# Altium schematic sheet RGMII.schdoc: =
size A3; Symbol: Sheet-Symbol_A4; Company: 嘉立创EDA; Version: V1.0; Page Size: A4; @Project Name: RK3568B2地瓜派; @Page Count: 27; @Update Date: 2025-09-23; @Create Date: 2025-09-11; @Schematic Name: Schematic1; @Page No: 20; @Page Name: RGMII; Device: Sheet-Symbol_A4; Border: 1; Title Block Position: 3; Width: 1655; Height: 1170; Region Start: 1; X Region Count: 6; Y Region Count: 4; Blade Width: 10; @Board Name: Board1; @Create Time: 22:20:05; @Update Time: 09:49:09; Organization: ORGANIZATION; Address1: ADDRESS 1; Address2: ADDRESS 2; Address3: ADDRESS 3; Address4: ADDRESS 4; SheetNumber: 19; SheetTotal: 28
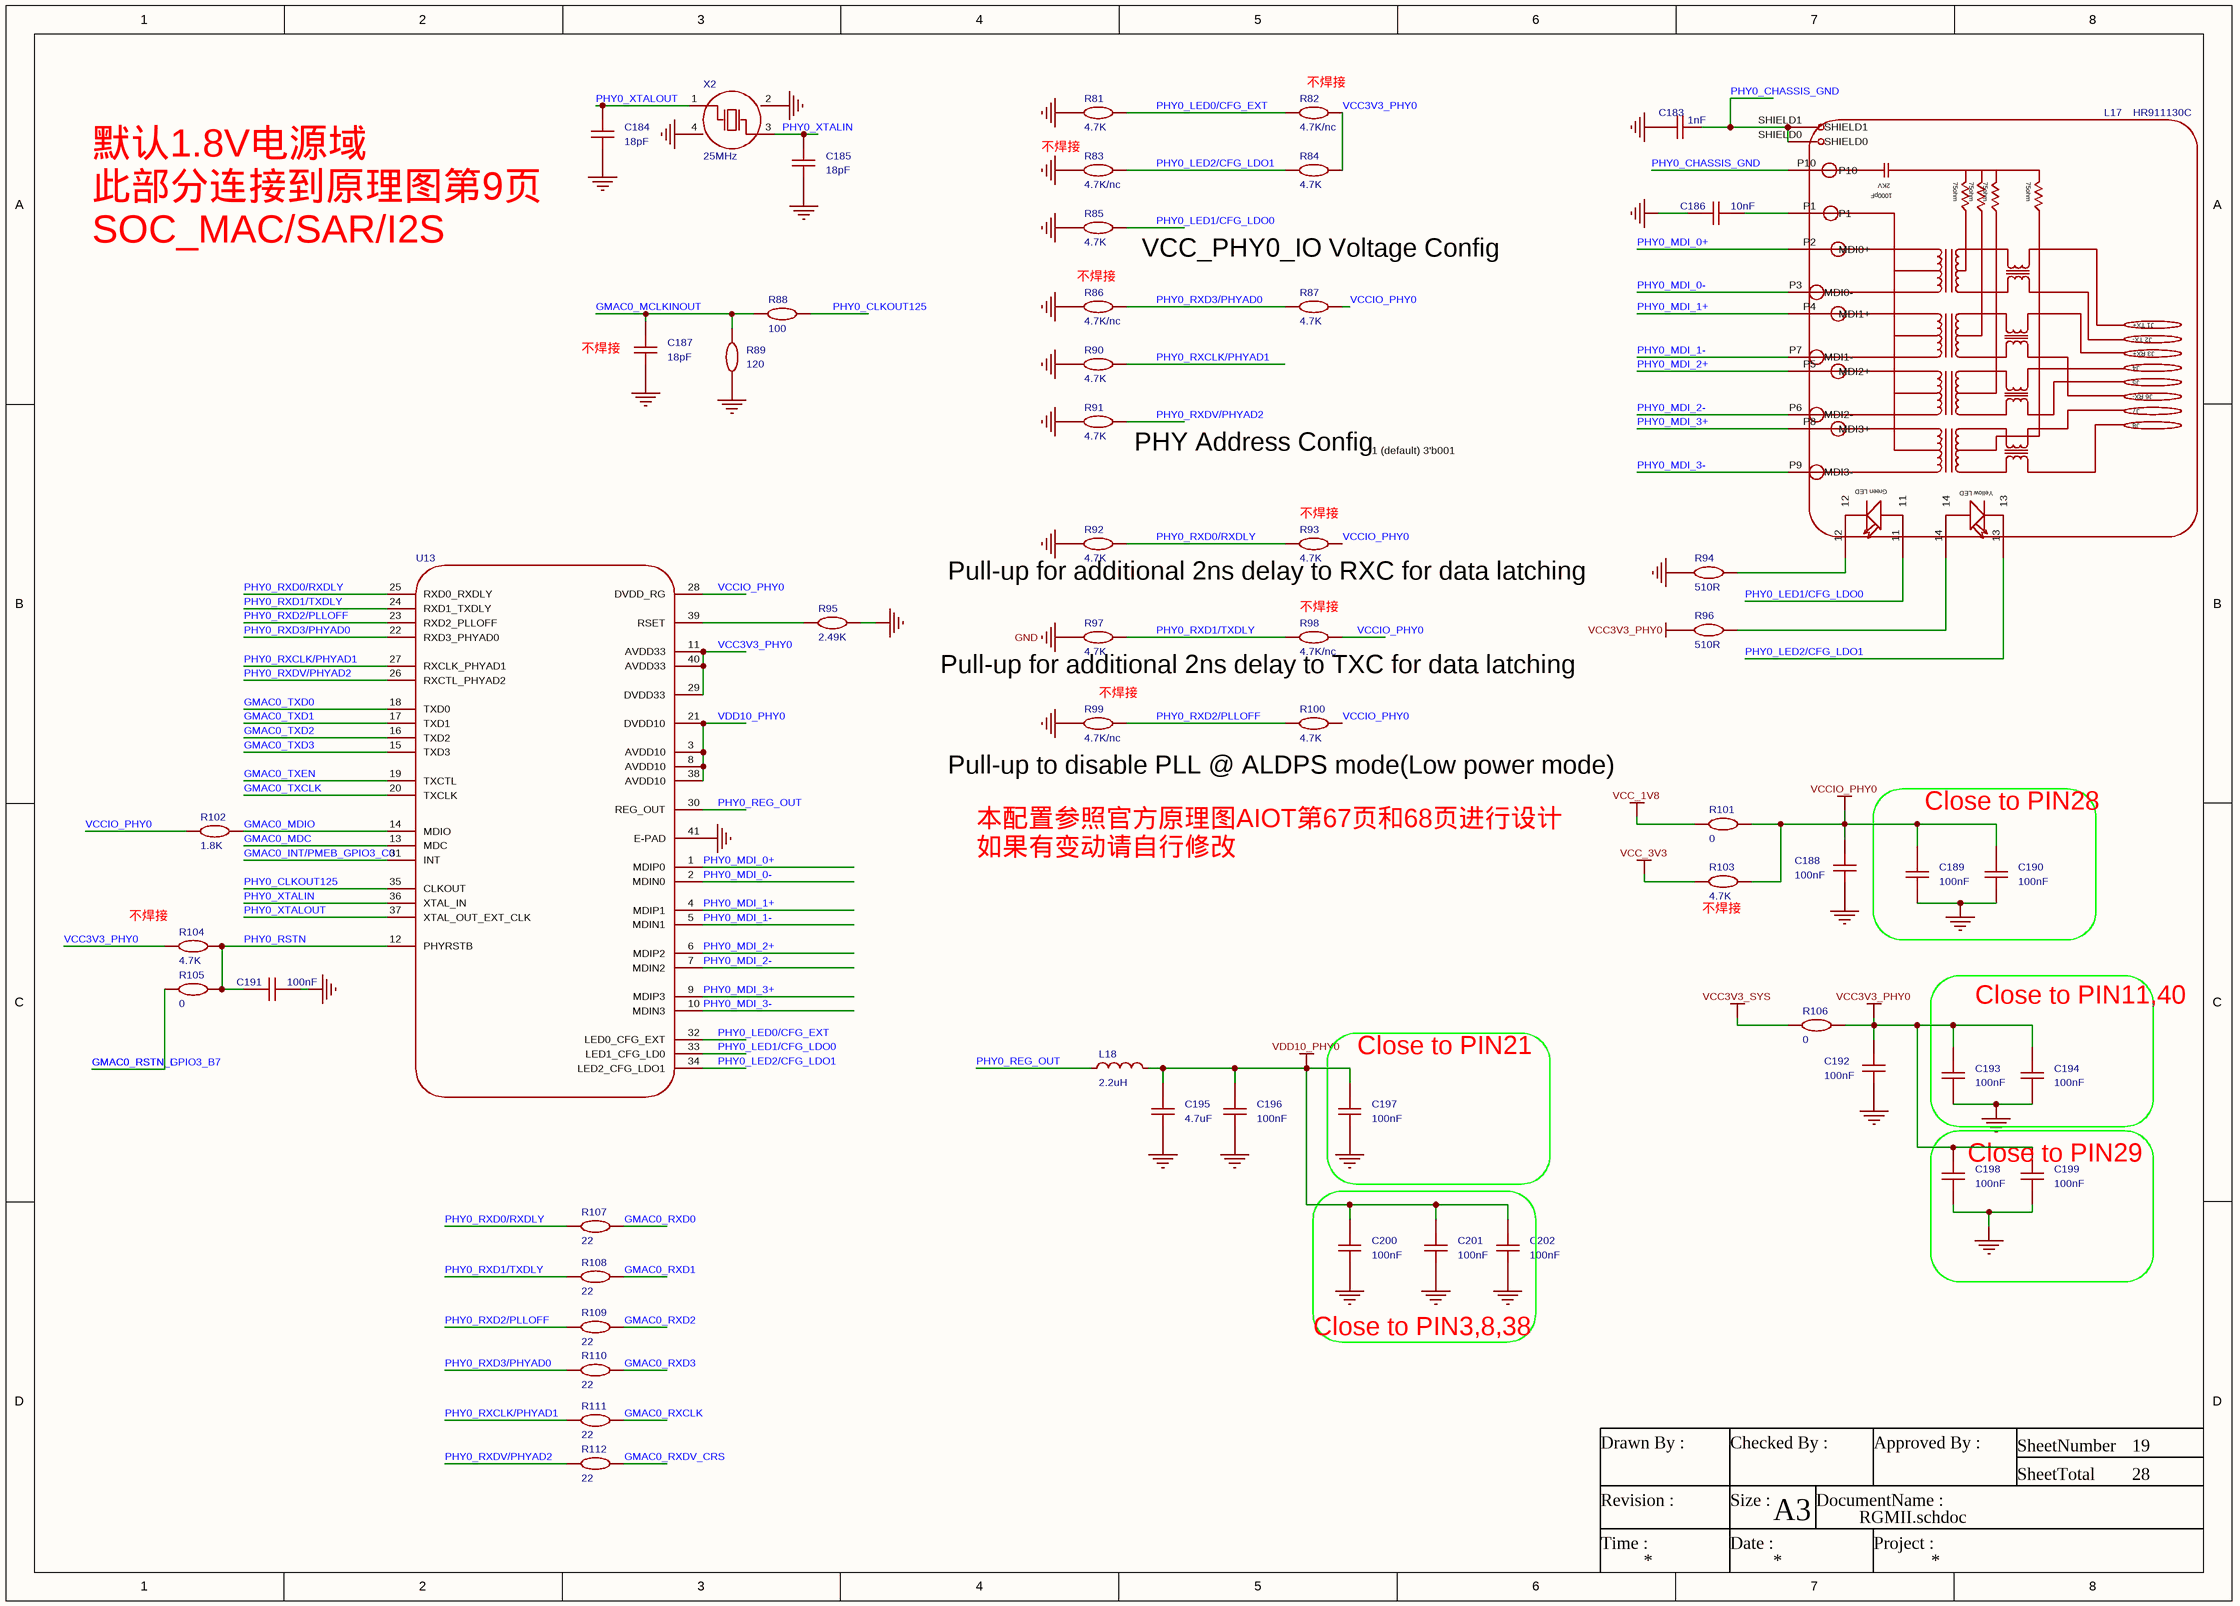
[diagram p0: RGMII.schdoc]

## Parts
C183  1nF  [C1206]
C184  value 18pF  [MYC0402]  (hidden comment: CL10A105KB8NNNC)
C185  value 18pF  [MYC0402]  (hidden comment: CL10A105KB8NNNC)
C186  value 10nF  [MYC0402]  (hidden comment: CL10A105KB8NNNC)
C187  value 18pF  [MYC0402]  (hidden comment: CL10A105KB8NNNC)
C188  100nF  [C0603]
C189  value 100nF  [MYC0402]  (hidden comment: CL10A105KB8NNNC)
C190  value 100nF  [MYC0402]  (hidden comment: CL10A105KB8NNNC)
C191  value 100nF  [MYC0402]  (hidden comment: CL10A105KB8NNNC)
C192  100nF  [C0603]
C193  value 100nF  [MYC0402]  (hidden comment: CL10A105KB8NNNC)
C194  value 100nF  [MYC0402]  (hidden comment: CL10A105KB8NNNC)
C195  4.7uF  [C0603]
C196  value 100nF  [MYC0402]  (hidden comment: CL10A105KB8NNNC)
C197  value 100nF  [MYC0402]  (hidden comment: CL10A105KB8NNNC)
C198  100nF  [C0603]
C199  value 100nF  [MYC0402]  (hidden comment: CL10A105KB8NNNC)
C200  value 100nF  [MYC0402]  (hidden comment: CL10A105KB8NNNC)
C201  value 100nF  [MYC0402]  (hidden comment: CL10A105KB8NNNC)
C202  value 100nF  [MYC0402]  (hidden comment: CL10A105KB8NNNC)
L17  HR911130C  [RJ45-TH_HR911130C]
L18  2.2uH  [IND-SMD_L2.5-W2.0_MHCHL2520]
R81  4.7K  [R0402]
R82  4.7K/nc  [R0402]
R83  4.7K/nc  [R0402]
R84  4.7K  [R0402]
R85  4.7K  [R0402]
R86  4.7K/nc  [R0402]
R87  4.7K  [R0402]
R88  100  [R0402]
R89  120  [R0402]
R90  4.7K  [R0402]
R91  4.7K  [R0402]
R92  4.7K  [R0402]
R93  4.7K  [R0402]
R94  510R  [R0402]
R95  2.49K  [R0402]
R96  510R  [R0402]
R97  4.7K  [R0402]
R98  4.7K/nc  [R0402]
R99  4.7K/nc  [R0402]
R100  4.7K  [R0402]
R101  0  [R0603]
R102  1.8K  [R0402]
R103  4.7K  [R0402]  (no BOM)
R104  4.7K  [R0402]
R105  0  [R0402]
R106  0  [R0603]
R107  22  [R0402]
R108  22  [R0402]
R109  22  [R0402]
R110  22  [R0402]
R111  22  [R0402]
R112  22  [R0402]
U13  (no value)  [RTL8211F-CG]
X2  25MHz  [CRYSTAL-SMD_4P-L3.2-W2.5-BL]

## Blocks framed on the sheet
Close to PIN28: C189 C190
Close to PIN11,40: C193 C194
Close to PIN21: C197
Close to PIN29: C198 C199
Close to PIN3,8,38: C200-C202

## Nets
GND: C183.1 C184.2 C185.2 C186.2 C187.2 C188.1 C189.2 C190.2 C191.1 C192.1 C193.2 C194.2 C195.1 C196.2 C197.2 C198.1 C199.2 C200.2 C201.2 C202.2 R81.1 R83.1 R85.1 R86.1 R89.1 R90.1 R91.1 R92.1 R94.1 R95.2 R97.1 R99.1 U13.41(E-PAD) X2.2(GND) X2.4(GND)
VCC3V3_PHY0: C192.2 C193.1 C194.1 C198.2 C199.1 R82.2 R84.2 R96.1 R104.1 R106.2 U13.11(AVDD33) U13.29(DVDD33) U13.40(AVDD33)
VCC3V3_SYS: R106.1
VCC_1V8: R101.1
VCC_3V3: R103.1
VCCIO_PHY0: C188.2 C189.1 C190.1 R87.2 R93.2 R98.2 R100.2 R101.2 R102.1 R103.2 U13.28(DVDD_RG)
VDD10_PHY0: C195.2 C196.1 C197.1 C200.1 C201.1 C202.1 L18.2 U13.3(AVDD10) U13.8(AVDD10) U13.21(DVDD10) U13.38(AVDD10)
GMAC0_INT/PMEB_GPIO3_C0: U13.31(INT)
GMAC0_MCLKINOUT: C187.1 R88.1 R89.2
GMAC0_MDC: U13.13(MDC)
GMAC0_MDIO: R102.2 U13.14(MDIO)
GMAC0_RSTN_GPIO3_B7: R105.1  [also labelled GMAC0_RSTN_L]
GMAC0_RXCLK: R111.2
GMAC0_RXD0: R107.2
GMAC0_RXD1: R108.2
GMAC0_RXD2: R109.2
GMAC0_RXD3: R110.2
GMAC0_RXDV_CRS: R112.2
GMAC0_TXCLK: U13.20(TXCLK)
GMAC0_TXD0: U13.18(TXD0)
GMAC0_TXD1: U13.17(TXD1)
GMAC0_TXD2: U13.16(TXD2)
GMAC0_TXD3: U13.15(TXD3)
GMAC0_TXEN: U13.19(TXCTL)
PHY0_CHASSIS_GND: C183.2 L17.P10 L17.SHIELD0 L17.SHIELD1
PHY0_CLKOUT125: R88.2 U13.35(CLKOUT)
PHY0_LED0/CFG_EXT: R81.2 R82.1 U13.32(LED0_CFG_EXT)
PHY0_LED1/CFG_LDO0: L17.11 R85.2 U13.33(LED1_CFG_LD0)
PHY0_LED2/CFG_LDO1: L17.13 R83.2 R84.1 U13.34(LED2_CFG_LDO1)
PHY0_MDI_0+: L17.P2(MDI0+) U13.1(MDIP0)
PHY0_MDI_0-: L17.P3(MDI0-) U13.2(MDIN0)
PHY0_MDI_1+: L17.P4(MDI1+) U13.4(MDIP1)
PHY0_MDI_1-: L17.P7(MDI1-) U13.5(MDIN1)
PHY0_MDI_2+: L17.P5(MDI2+) U13.6(MDIP2)
PHY0_MDI_2-: L17.P6(MDI2-) U13.7(MDIN2)
PHY0_MDI_3+: L17.P8(MDI3+) U13.9(MDIP3)
PHY0_MDI_3-: L17.P9(MDI3-) U13.10(MDIN3)
PHY0_REG_OUT: L18.1 U13.30(REG_OUT)
PHY0_RSTN: C191.2 R104.2 R105.2 U13.12(PHYRSTB)
PHY0_RXCLK/PHYAD1: R90.2 R111.1 U13.27(RXCLK_PHYAD1)
PHY0_RXD0/RXDLY: R92.2 R93.1 R107.1 U13.25(RXD0_RXDLY)
PHY0_RXD1/TXDLY: R97.2 R98.1 R108.1 U13.24(RXD1_TXDLY)
PHY0_RXD2/PLLOFF: R99.2 R100.1 R109.1 U13.23(RXD2_PLLOFF)
PHY0_RXD3/PHYAD0: R86.2 R87.1 R110.1 U13.22(RXD3_PHYAD0)
PHY0_RXDV/PHYAD2: R91.2 R112.1 U13.26(RXCTL_PHYAD2)
PHY0_XTALIN: C185.1 U13.36(XTAL_IN) X2.3(OSC2)
PHY0_XTALOUT: C184.1 U13.37(XTAL_OUT_EXT_CLK) X2.1(OSC1)
NetC186_1: C186.1 L17.P1
NetL17_12: L17.12 R94.2
NetL17_14: L17.14 R96.2
NetR95_1: R95.1 U13.39(RSET)

## Notes on the sheet
- (near R82) 不焊接
- 不焊接
- VCC_PHY0_IO Voltage Config
- (near R86) 不焊接
- 默认1.8V电源域
  此部分连接到原理图第9页
  SOC_MAC/SAR/I2S
- (near C187) 不焊接
- (near R91) PHY Address Config
- 1 (default) 3'b001
- (near R93) 不焊接
- Pull-up for additional 2ns delay to RXC for data latching
- (near R98) 不焊接
- Pull-up for additional 2ns delay to TXC for data latching
- (near R99) 不焊接
- Pull-up to disable PLL @ ALDPS mode(Low power mode)
- (near R103) 不焊接
- (near R104) 不焊接
- 本配置参照官方原理图AIOT第67页和68页进行设计
  如果有变动请自行修改
- Drawn By :
- Checked By :
- Approved By :
- SheetNumber
- SheetTotal
- Revision :
- Time :
- Size :
- Date :
- A3
- DocumentName :
- Project :
- (in symbol HR911130C) 2KV; 75ohm; 1000pF; J1 TX+; J2 TX-; J3 RX+; J4; J5; J6 RX-; J7; J8; Green LED; Yellow LED

## Library data of the parts
C183 = 1206B102K202NT: 容值:1nF;精度:±10%;额定电压:2kV;温度系数:X7R;; Manufacturer: FH(风华); AddInBom: yes; ModelId: e4be705b945545a48e666415e3682bd8; ModelName: C1206_L3.2-W1.6-H1.3; ModelTransform: 125.984,62.992,0,0,0,0,0,0,0; Tolerance: ±10%; Voltage Rating: 2kV; Temperature Coefficient: X7R; Symbol: 1206B102K202NT; Device: 1206B102K202NT; LCSC Part Name: 1nF ±10% 2kV; SupplierPart: C9196; ManufacturerPart: 1206B102K202NT; Supplier Footprint: 1206; JLCPCB Part Class: 基础库; Datasheet: https://atta.szlcsc.com/upload/public/pdf/source/20200305/C486355_26A10D38EF8C2A5C37091D0039909270.pdf; Supplier: LCSC; ConvertToPcb: yes; FootprintName: C1206; Value: 1nF
C184-C186 C189-C191 C193 C194 C196 C197 C199-C202 = CL10A105KB8NNNC: 容值:1uF;精度:±10%;额定电压:50V;材质(温度系数):X5R;; Manufacturer: SAMSUNG(三星); Symbol: CapAcitance; AddInBom: yes; ModelId: ac125912035d415993ca9572d50418b1; ModelName: C0603_L1.6-W0.8-H0.8; ModelTransform: 62.992,31.496,0,0,0,0,0,0,0; Tolerance: ±10%; Voltage Rated: 50V; Temperature Coefficient: X5R; Device: CL10A105KB8NNNC; LCSC Part Name: 1uF ±10% 50V; ManufacturerPart: CL10A105KB8NNNC; Supplier Footprint: 0603; JLCPCB Part Class: Basic Part; Datasheet: https://atta.szlcsc.com/upload/public/pdf/source/20160103/1457707679084.pdf; Supplier: LCSC; ConvertToPcb: yes; FootprintName: MYC0402
C187 = CL10A105KB8NNNC: 容值:1uF;精度:±10%;额定电压:50V;材质(温度系数):X5R;; Manufacturer: SAMSUNG(三星); Symbol: CapAcitance; Add into BOM: no; ConvertToPcb: yes; ModelId: ac125912035d415993ca9572d50418b1; ModelName: C0603_L1.6-W0.8-H0.8; ModelTransform: 62.992,31.496,0,0,0,0,0,0,0; Tolerance: ±10%; Voltage Rated: 50V; Temperature Coefficient: X5R; Device: CL10A105KB8NNNC; LCSC Part Name: 1uF ±10% 50V; ManufacturerPart: CL10A105KB8NNNC; Supplier Footprint: 0603; JLCPCB Part Class: Basic Part; Datasheet: https://atta.szlcsc.com/upload/public/pdf/source/20160103/1457707679084.pdf; Supplier: LCSC; FootprintName: MYC0402
C188 C192 C195 C198 = CAP_0603: ConvertToPcb: yes; SymbolName: Capacitance; ModelId: ac125912035d415993ca9572d50418b1; ModelName: C0603_L1.6-W0.8-H0.8; ModelTransform: 62.992,31.496,0,0,0,0,0,0,0; Device: CAP_0603; AddInBom: yes; Supplier Footprint: 0603; FootprintName: C0603
  C188 C192 C198: Value: 100nF
  C195: Value: 4.7uF
L17 = HR911130C: 连接器类型:RJ45插座;端口数量:1;安装方式:弯插;屏蔽:有屏蔽;LED:带LED;等级:-;工作温度范围:-;; Manufacturer: HANRUN(汉仁); AddInBom: yes; ModelId: 59c82772a4104c30b0c5165fbd81f083; ModelTransform: 716.118,838.62,0,180,0,0,0,86.614,-157.48; Connector Type: RJ45插座; Number of Ports: 1; Shielding: 有屏蔽; LED: 带LED; Symbol: HR911130C; Device: HR911130C; LCSC Part Name: 弯插 带LED; SupplierPart: C50933; ManufacturerPart: HR911130C; Supplier Footprint: 插件; JLCPCB Part Class: 扩展库; Datasheet: https://atta.szlcsc.com/upload/public/pdf/source/20240108/FEC80AF9B295891E58BF4ACD53537D33.pdf; Supplier: LCSC; ConvertToPcb: yes; FootprintName: RJ45-TH_HR911130C; ModelName: RJ45-TH_HR911130C; Mounting Style: 弯插; Ratings: -; Operating Temperature Range: -
L18 = FTC252012S2R2MBCA: 电感值:2.2uH;精度:±20%;额定电流:3A;饱和电流(Isat):3.8A;类型:一体成型电感;; Manufacturer: cjiang(长江微电); AddInBom: yes; ModelId: 37a0cdb2b8b148059a23edc55a737e42; ModelTransform: 98.425,78.74,0,0,0,0,0,0,0; Tolerance: ±20%; Rated Current: 3A; Saturation Current (Isat): 3.8A; DC Resistance (DCR): 55mΩ; Type: 一体成型电感; Symbol: FTC252012S2R2MBCA; Device: FTC252012S2R2MBCA; LCSC Part Name: 2.2uH ±20% 3.8A; SupplierPart: C5832372; ManufacturerPart: FTC252012S2R2MBCA; Supplier Footprint: 1008; JLCPCB Part Class: 扩展库; Datasheet: https://atta.szlcsc.com/upload/public/pdf/source/20230602/8FFEDA9C0247A92A0D4B67554BFE4091.pdf; Supplier: LCSC; ConvertToPcb: yes; FootprintName: IND-SMD_L2.5-W2.0_MHCHL2520; ModelName: IND-SMD_L2.5-W2.0_MHCHL2520; Value: 2.2uH
R81 R84 R85 R87-R92 R94-R97 R100 R102-R105 R107-R112 = Res_0402: Symbol: 电阻; ConvertToPcb: yes; ModelId: 671aefced39d4c318694bba8bd8efd39; ModelName: R0402_L1.0-W0.5-H0.5; ModelTransform: 39.37,19.685,0,0,0,0,0,0.0005,0; Device: Res_0402; AddInBom: yes; Supplier Footprint: 0402; FootprintName: R0402
  R81 R84 R85 R87 R90-R92 R97 R100 R103 R104: Value: 4.7K
  R88: Value: 100
  R89: Value: 120
  R94 R96: Value: 510R
  R95: Value: 2.49K
  R102: Value: 1.8K
  R105: Value: 0
  R107-R112: Value: 22
R82 R86 R93 R98 R99 = Res_0402: Symbol: 电阻; Add into BOM: no; ConvertToPcb: yes; ModelId: 671aefced39d4c318694bba8bd8efd39; ModelName: R0402_L1.0-W0.5-H0.5; ModelTransform: 39.37,19.685,0,0,0,0,0,0.0005,0; Device: Res_0402; Supplier Footprint: 0402; FootprintName: R0402
  R82 R86 R98 R99: Value: 4.7K/nc
  R93: Value: 4.7K
R83 = Res_0402: Symbol: 电阻; Convert to PCB: yes; Add into BOM: no; ModelId: 671aefced39d4c318694bba8bd8efd39; ModelName: R0402_L1.0-W0.5-H0.5; ModelTransform: 39.37,19.685,0,0,0,0,0,0.0005,0; Value: 4.7K/nc; Device: Res_0402; Supplier Footprint: 0402; FootprintName: R0402
R101 R106 = Res_0603: Symbol: 电阻; ConvertToPcb: yes; ModelId: fc143cca1e79419f9cd78b61e9279f08; ModelTransform: 31.8897,63.7794,0,90,0,0,0,0,0; Value: 0; Device: Res_0603; AddInBom: yes; Supplier Footprint: 0603; FootprintName: R0603; ModelName: R0603
U13 = RTL8211F-CG: AddInBom: yes; Symbol: RTL8211F-CG; Device: RTL8211F-CG; ConvertToPcb: yes; FootprintName: RTL8211F-CG
X2 = X322525MOB4SI: 晶振类型:贴片晶振;频率:25MHz;常温频差:±10ppm;负载电容:12pF;频率稳定度:±20ppm;; Manufacturer: YXC(扬兴晶振); AddInBom: yes; ModelId: 02485e56ba8d4732a26526d2983fc729; ModelTransform: 125.984,98.425,0,0,0,0,0,0,0; Normal temperature Frequency Tolerance: ±10ppm; Load Capacitance: 12pF; Frequency Stability: ±20ppm; Symbol: X322525MOB4SI; Device: X322525MOB4SI; LCSC Part Name: YSX321SL 25MHZ 4P 3225 12PF ±10PPM -40~85℃ (±20PPM); SupplierPart: C9006; ManufacturerPart: X322525MOB4SI; Supplier Footprint: SMD3225-4P; JLCPCB Part Class: 基础库; Datasheet: https://item.szlcsc.com/datasheet/X322525MOB4SI/9526.html; Supplier: LCSC; ConvertToPcb: yes; FootprintName: CRYSTAL-SMD_4P-L3.2-W2.5-BL; ModelName: CRYSTAL-SMD_4P-L3.2-W2.5-BL; Type: 贴片晶振; Value: 25MHz; Operating Temperature: -40℃~+85℃